# EAGLE schematic untitled (EAGLE 8.0.1)
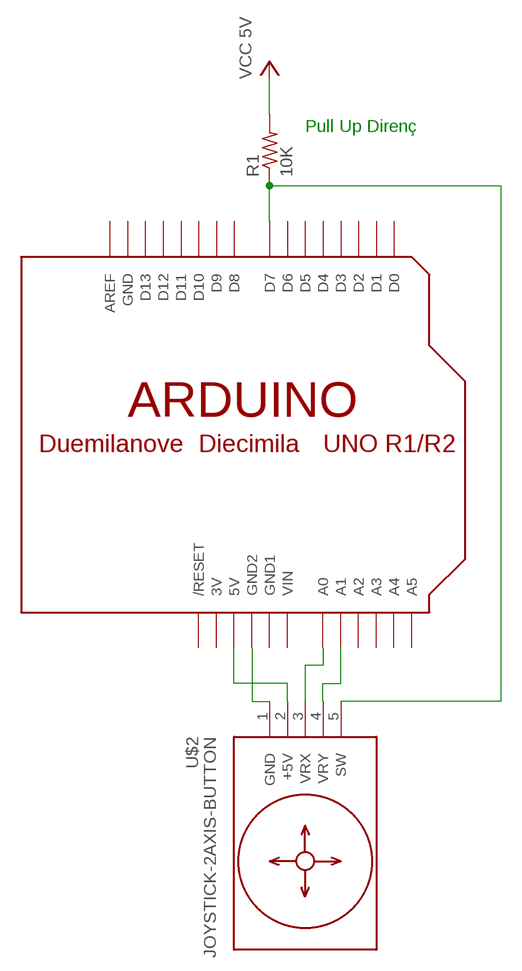
[diagram p0: schematic, sheet 1]

## Parts
R1  10K  R-US_0204/5  [0204/5]
U$1  ARDUINOUNO  [ARDUINO]
U$2  JOYSTICK-2AXIS-BUTTON  [JOYSTICK-2AXIS-BUTTON]

## Nets
N$1: U$1.GND2 U$2.1(GND)
N$2: U$1.5V U$2.2(+5V)
N$3: U$1.A0 U$2.3(VRX)
N$4: U$1.A1 U$2.4(VRY)
N$5: R1.1 U$1.D7 U$2.5(SW)
VCC: R1.2 ; supply symbol labelled VCC 5V
Unconnected: U$1.A2 U$1.A3 U$1.A4 U$1.A5 U$1.AREF U$1.D0 U$1.D1 U$1.D2 U$1.D3 U$1.D4 U$1.D5 U$1.D6 U$1.D8 U$1.D9 U$1.D10 U$1.D11 U$1.D12 U$1.D13 U$1.RESET(/RESET)

## Notes on the sheet
- Pull Up Direnç

## Power pins joined to a net without a drawn wire
3V: U$1.3V
GND: U$1.GND
GND1: U$1.GND1
VIN: U$1.VIN

## Library data of the parts
R1 = adafruit:R-US_: RESISTOR, American symbol
U$1 = adafruit:ARDUINO: Arduino Diecimila/Duemilanove Make a shield with ease, this package has all the named pins as well as the two mounting drill holes and an outline of the USB and DC power connector. The outline is on the DIMENSION layer, so if your board house uses it they will cut the outline to match. http://www.ladyada.net/library/pcb/eaglelibrary.html
U$2 = diy-modules:JOYSTICK-2AXIS-BUTTON: 2-Axis Analog Joystick with Push Button Tutorial is available here: http://henrysbench.capnfatz.com/henrys-bench/arduino-sensors-and-input/arduino-ps2-joystick-tutorial-keyes-ky-023-deek-robot/ Click here to find device on ebay.com <http://www.ebay.com/sch/joystick+ps2+module>